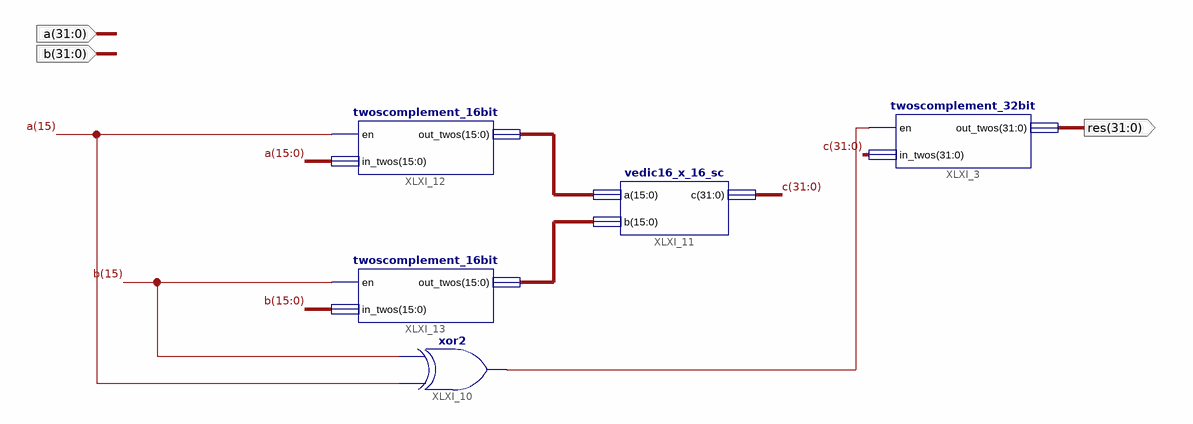
[diagram p0: schematic sheet 1]
// Xilinx ISE schematic vedic16_x_16_signed_sc.sch (spartan6) as structural Verilog: 5 symbols, 3 ports
module vedic16_x_16_signed_sc (
  input  [31:0] a,
  input  [31:0] b,
  output [31:0] res
);

  wire XLXN_16;
  wire [15:0] XLXN_17, XLXN_18;
  wire [31:0] c;

  twoscomplement_32bit XLXI_3 (.en(XLXN_16), .in_twos(c), .out_twos(res));
  xor XLXI_10 (XLXN_16, a[15], b[15]);
  vedic16_x_16_sc XLXI_11 (.a(XLXN_17), .b(XLXN_18), .c(c));
  twoscomplement_16bit XLXI_12 (.en(a[15]), .in_twos(a[15:0]), .out_twos(XLXN_17));
  twoscomplement_16bit XLXI_13 (.en(b[15]), .in_twos(b[15:0]), .out_twos(XLXN_18));
endmodule
